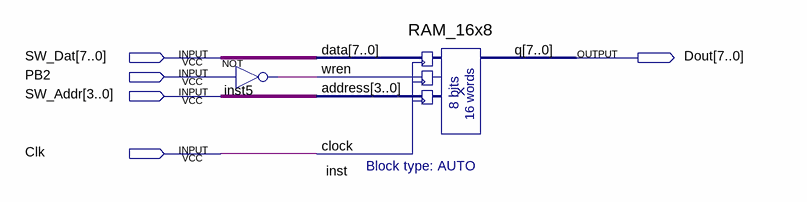
[diagram p0: schematic sheet]
// Quartus schematic RAM.bdf as structural Verilog: 2 symbols, 5 pins
module RAM (
  input  [7:0] SW_Dat,
  input  PB2,
  input  [3:0] SW_Addr,
  input  Clk,
  output [7:0] Dout
);

  wire inst5_out;

  not inst5 (inst5_out, PB2);
  RAM_16x8 inst (.data(SW_Dat), .wren(inst5_out), .address(SW_Addr), .clock(Clk), .q(Dout));
endmodule
